# Altium schematic sheet Single_channel_Mobo.SchDoc
size A3
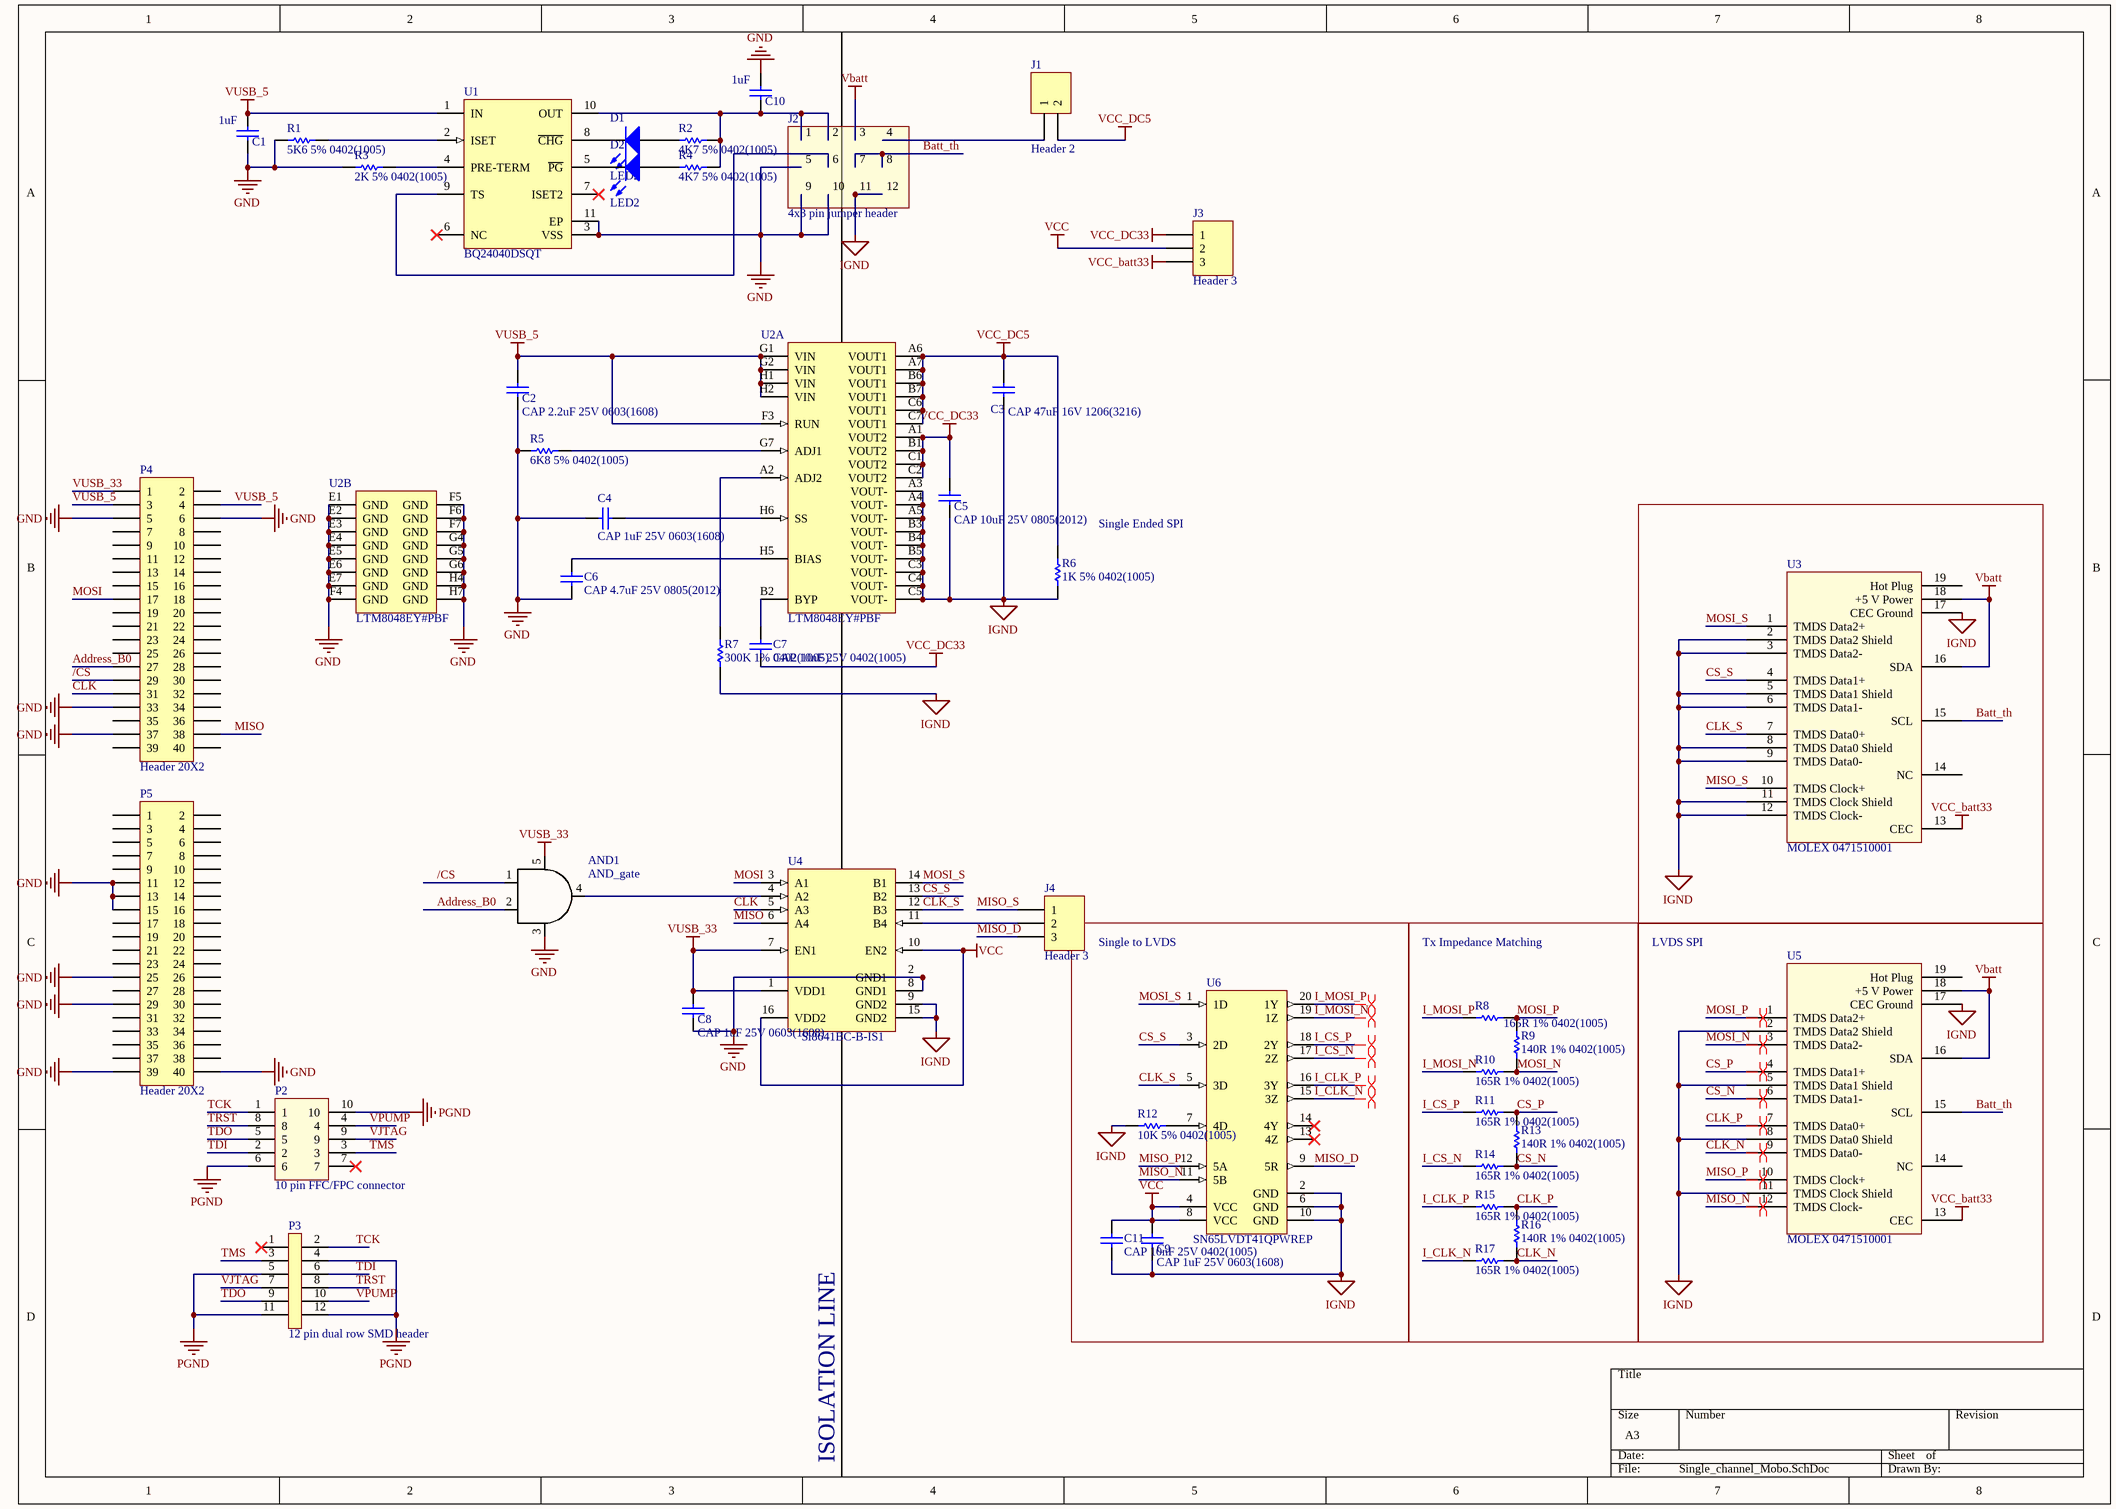
[diagram p0: Single_channel_Mobo.SchDoc]

## Parts
AND1  AND_gate  [TSOP5]
C1  value 1uF  [CAPC0603(1608)100_L]  (hidden comment: CAP 1uF 25V 0603(1608))
C2  CAP 2.2uF 25V 0603(1608)  [CAPC0603(1608)100_M]
C3  CAP 47uF 16V 1206(3216)  [CAPC1206(3216)190_M]
C4  CAP 1uF 25V 0603(1608)  [CAPC0603(1608)100_L]
C5  CAP 10uF 25V 0805(2012)  [CAPC0805(2012)145_N]
C6  CAP 4.7uF 25V 0805(2012)  [CAPC0805(2012)145_L]
C7  CAP 10nF 25V 0402(1005)  [CAPC0402(1005)60_L]
C8  CAP 1uF 25V 0603(1608)  [CAPC0603(1608)100_L]
C9  CAP 1uF 25V 0603(1608)  [CAPC0603(1608)100_L]
C10  value 1uF  [CAPC0603(1608)100_L]  (hidden comment: CAP 1uF 25V 0603(1608))
C11  CAP 10nF 25V 0402(1005)  [CAPC0402(1005)60_L]
D1  LED2  [LED 0610]
D2  LED2  [LED 0610]
J1  Header 2  [HDR1X2]
J2  4x3 pin jumper header  [4x3 pin jumper header]
J3  Header 3  [HDR1X3]
J4  Header 3  [HDR1X3]
P2  10 pin FFC/FPC connector  [10 FFC/FPC connector 0.5mm pitch]
P3  12 pin dual row SMD header  [TSM-106-01-S-DH]
P4  Header 20X2
P5  Header 20X2
R1  5K6 5% 0402(1005)  [RESC0402(1005)_L]
R2  4K7 5% 0402(1005)  [RESC0402(1005)_L]
R3  2K 5% 0402(1005)  [RESC0402(1005)_N]
R4  4K7 5% 0402(1005)  [RESC0402(1005)_L]
R5  6K8 5% 0402(1005)  [RESC0402(1005)_M]
R6  1K 5% 0402(1005)  [RESC0402(1005)_L]
R7  300K 1% 0402(1005)  [RESC0402(1005)_L]
R8  165R 1% 0402(1005)  [RESC0402(1005)_M]
R9  140R 1% 0402(1005)  [RESC0402(1005)_M]
R10  165R 1% 0402(1005)  [RESC0402(1005)_M]
R11  165R 1% 0402(1005)  [RESC0402(1005)_M]
R12  10K 5% 0402(1005)  [RESC0402(1005)_N]
R13  140R 1% 0402(1005)  [RESC0402(1005)_M]
R14  165R 1% 0402(1005)  [RESC0402(1005)_M]
R15  165R 1% 0402(1005)  [RESC0402(1005)_M]
R16  140R 1% 0402(1005)  [RESC0402(1005)_M]
R17  165R 1% 0402(1005)  [RESC0402(1005)_M]
U1  BQ24040DSQT  [DSQ10-1500X900TP]
U2  LTM8048EY#PBF  [LT-BGA-45-11250X9000X4920]  (parts A,B of 2)
U3  MOLEX 0471510001  [MOLEX 0471510001]
U4  Si8641BC-B-IS1  [SLAB-SOIC-16-NB_M]
U5  MOLEX 0471510001  [MOLEX 0471510001]
U6  SN65LVDT41QPWREP  [PW20_L]

## Blocks framed on the sheet
Single to LVDS: C9 C11 R12 U6
Tx Impedance Matching: R8-R11 R13-R17
LVDS SPI: U5

## Nets
GND: AND1.3(GND) C1.1 C2.1 C4.2 C6.2 C8.1 C10.2 J2.5 J2.9 J2.10 P4.5 P4.6 P4.33 P4.37 P5.11 P5.13 P5.15 P5.25 P5.29 P5.39 P5.40 R1.2 R3.2 R5.2 U1.3(VSS) U1.11(EP) U2.E1(GND) U2.E2(GND) U2.E3(GND) U2.E4(GND) U2.E5(GND) U2.E6(GND) U2.E7(GND) U2.F4(GND) U2.F5(GND) U2.F6(GND) U2.F7(GND) U2.G4(GND) U2.G5(GND) U2.G6(GND) U2.H4(GND) U2.H7(GND) U4.2(GND1) U4.8(GND1)
IGND: C3.1 C5.1 C9.1 C11.1 J2.11 J2.12 R6.1 R7.2 R12.1 U2.A3(VOUT-) U2.A4(VOUT-) U2.A5(VOUT-) U2.B3(VOUT-) U2.B4(VOUT-) U2.B5(VOUT-) U2.C3(VOUT-) U2.C4(VOUT-) U2.C5(VOUT-) U3.2(TMDS_Data2_Shield) U3.3(TMDS_Data2-) U3.5(TMDS_Data1_Shield) U3.6(TMDS_Data1-) U3.8(TMDS_Data0_Shield) U3.9(TMDS_Data0-) U3.11(TMDS_Clock_Shield) U3.12(TMDS_Clock-) U3.17(CEC_Ground) U4.9(GND2) U4.15(GND2) U5.2(TMDS_Data2_Shield) U5.5(TMDS_Data1_Shield) U5.8(TMDS_Data0_Shield) U5.11(TMDS_Clock_Shield) U5.17(CEC_Ground) U6.2(GND) U6.6(GND) U6.10(GND)
PGND: P2.6 P2.10 P3.4 P3.5 P3.11 P3.12
Vbatt: J2.3 U3.16(SDA) U3.18(+5_V_Power) U5.16(SDA) U5.18(+5_V_Power)
VCC: C9.2 C11.2 J3.2 U4.10(EN2) U4.16(VDD2) U6.4(VCC) U6.8(VCC)
VCC_batt33: J3.3 U3.13(CEC) U5.13(CEC)
VCC_DC5: C3.2 J1.2 R6.2 U2.A6(VOUT1) U2.A7(VOUT1) U2.B6(VOUT1) U2.B7(VOUT1) U2.C6(VOUT1) U2.C7(VOUT1)
VCC_DC33: C5.2 C7.1 J3.1 U2.A1(VOUT2) U2.B1(VOUT2) U2.C1(VOUT2) U2.C2(VOUT2)
VUSB_5: C1.2 C2.2 P4.3 P4.4 U1.1(IN) U2.F3(RUN) U2.G1(VIN) U2.G2(VIN) U2.H1(VIN) U2.H2(VIN)
VUSB_33: AND1.5(VCC) C8.2 P4.1 U4.1(VDD1) U4.7(EN1)
/CS: AND1.1(B) P4.29
Address_B0: AND1.2(A) P4.27
Batt_th: J2.7 J2.8 U3.15(SCL) U5.15(SCL)
CLK: P4.31 U4.5(A3)
CLK_N: R16.1 R17.1 U5.9(TMDS_Data0-)
CLK_P: R15.1 R16.2 U5.7(TMDS_Data0+)
CLK_S: U3.7(TMDS_Data0+) U4.12(B3) U6.5(3D)
CS_N: R13.1 R14.1 U5.6(TMDS_Data1-)
CS_P: R11.1 R13.2 U5.4(TMDS_Data1+)
CS_S: U3.4(TMDS_Data1+) U4.13(B2) U6.3(2D)
I_CLK_N: R17.2 U6.15(3Z)
I_CLK_P: R15.2 U6.16(3Y)
I_CS_N: R14.2 U6.17(2Z)
I_CS_P: R11.2 U6.18(2Y)
I_MOSI_N: R10.2 U6.19(1Z)
I_MOSI_P: R8.2 U6.20(1Y)
MISO: P4.38 U4.6(A4)
MISO_D: J4.3 U6.9(5R)
MISO_N: U5.12(TMDS_Clock-) U6.11(5B)
MISO_P: U5.10(TMDS_Clock+) U6.12(5A)
MISO_S: J4.1 U3.10(TMDS_Clock+)
MOSI: P4.17 U4.3(A1)
MOSI_N: R9.1 R10.1 U5.3(TMDS_Data2-)
MOSI_P: R8.1 R9.2 U5.1(TMDS_Data2+)
MOSI_S: U3.1(TMDS_Data2+) U4.14(B1) U6.1(1D)
TCK: P2.1 P3.2
TDI: P2.2 P3.6
TDO: P2.5 P3.9
TMS: P2.3 P3.3
TRST: P2.8 P3.8
VJTAG: P2.9 P3.7
VPUMP: P2.4 P3.10
NetAND1_4: AND1.4(Y) U4.4(A2)
NetC4_1: C4.1 U2.H6(SS)
NetC6_1: C6.1 U2.H5(BIAS)
NetC7_2: C7.2 U2.B2(BYP)
NetC10_1: C10.1 J2.1 J2.2 R2.2 R4.1 U1.10(OUT)
NetD1_1: D1.1(A) R2.1
NetD1_2: D1.2(K) U1.8(~{CHG})
NetD2_1: D2.1(A) R4.2
NetD2_2: D2.2(K) U1.5(~{PG})
NetJ1_1: J1.1 J2.4
NetJ2_6: J2.6 U1.9(TS)
NetJ4_2: J4.2 U4.11(B4)
NetR1_1: R1.1 U1.2(ISET)
NetR3_1: R3.1 U1.4(PRE-TERM)
NetR5_1: R5.1 U2.G7(ADJ1)
NetR7_1: R7.1 U2.A2(ADJ2)
NetR12_2: R12.2 U6.7(4D)

Not connected (* = marked no-connect by the designer): P2 7*; P3 1*; P4 2 7 8 9 10 11 12 13 14 15 16 18 19 20 21 22 23 24 25 26 28 30 32 34 35 36 39 40; P5 1 2 3 4 5 6 7 8 9 10 12 14 16 17 18 19 20 21 22 23 24 26 27 28 30 31 32 33 34 35 36 37 38; U1 6(NC)* 7(ISET2)*; U3 14(NC) 19(Hot_Plug); U5 14(NC) 19(Hot_Plug); U6 13(4Z)* 14(4Y)*

## Layout directives
differential pair: CLK_N, CLK_P, CS_N, CS_P, I_CLK_N, I_CLK_P, I_CS_N, I_CS_P, I_MOSI_N, I_MOSI_P, MISO_N, MISO_P, MOSI_N, MOSI_P

## Notes on the sheet
- (near R6) Single Ended SPI
- ISOLATION LINE

## Library data of the parts
C1 C4 C8-C10 = CMP-1035-02740-1: CAP 1uF 25V ±10% 0603 (1608 Metric) Thickness 1mm SMD; Case-Metric: 1608; Case-EIA: 0603; Technology: SMT; Tolerance: ±10%; Max Thickness: 1 mm; Rated Voltage: 25 V
  C4 C8 C9: Value: 1uF
C2 = CMP-1035-02767-1: CAP 2.2uF 25V ±10% 0603 (1608 Metric) Thickness 1mm SMD; Case-Metric: 1608; Case-EIA: 0603; Technology: SMT; Value: 2.2uF; Tolerance: ±10%; Max Thickness: 1 mm; Rated Voltage: 25 V
C3 = CMP-1037-05003-1: CAP 47uF 16V ±20% 1206 (3216 Metric) Thickness 1.9mm SMD; Case-Metric: 3216; Case-EIA: 1206; Tolerance: ±20%; Value: 47uF; Technology: SMT; Max Thickness: 1.9 mm; Rated Voltage: 16 V
C5 = CMP-1036-04932-1: CAP 10uF 25V ±10% 0805 (2012 Metric) Thickness 1.45mm SMD; Case-Metric: 2012; Case-EIA: 0805; Technology: SMT; Value: 10uF; Tolerance: ±10%; Max Thickness: 1.45 mm; Rated Voltage: 25 V
C6 = CMP-1036-04895-1: CAP 4.7uF 25V ±10% 0805 (2012 Metric) Thickness 1.45mm SMD; Case-Metric: 2012; Case-EIA: 0805; Value: 4.7uF; Technology: SMT; Tolerance: ±10%; Max Thickness: 1.45 mm; Rated Voltage: 25 V
C7 C11 = CMP-1034-01879-1: CAP 10nF 25V ±5% 0402 (1005 Metric) Thickness 0.6mm SMD; Case-Metric: 1005; Case-EIA: 0402; Value: 10nF; Tolerance: ±5%; Technology: SMT; Max Thickness: 0.6 mm; Rated Voltage: 25 V
D1 D2 = LED2: Typical RED, GREEN, YELLOW, AMBER GaAs LED; Published: 8-Jun-2000; LatestRevisionDate: 17-Jul-2002; LatestRevisionNote: Re-released for DXP Platform.; PackageVersion: Feb-2002; PackageReference: 3.2X1.6X1.1; Publisher: Altium Limited; PackageDescription: SM LED; 2 Flat Leads
J1 = Header 2: Header, 2-Pin; LatestRevisionDate: 17-Jul-2002; LatestRevisionNote: Re-released for DXP Platform.; Publisher: Altium Limited
J3 J4 = Header 3: Header, 3-Pin; LatestRevisionDate: 17-Jul-2002; LatestRevisionNote: Re-released for DXP Platform.; Publisher: Altium Limited
P3 = 12 pin dual row SMD header: header
P4 P5 = Header 20X2: Header, 20-Pin, Dual row; LatestRevisionDate: 17-Jul-2002; LatestRevisionNote: Re-released for DXP Platform.; Publisher: Altium Limited
R1 = CMP-1011-00092-1: 5K6 0.063W 5% 0402 (1005 Metric)  SMD; Case-Metric: 1005; Value: 5600.00 Ohm; Case-EIA: 0402; Technology: SMT; Tolerance: 5 %; Power: 0.063 W
R2 R4 = CMP-1011-00090-1: 4K7 0.063W 5% 0402 (1005 Metric)  SMD; Value: 4700.00 Ohm; Case-Metric: 1005; Case-EIA: 0402; Tolerance: 5 %; Power: 0.063 W; Technology: SMT
R3 = CMP-1011-00081-1: 2K 0.063W 5% 0402 (1005 Metric)  SMD; Case-Metric: 1005; Value: 2000.00 Ohm; Case-EIA: 0402; Power: 0.063 W; Technology: SMT; Tolerance: 5 %
R5 = CMP-1011-00094-1: 6K8 0.063W 5% 0402 (1005 Metric)  SMD; Value: 6800.00 Ohm; Case-Metric: 1005; Case-EIA: 0402; Power: 0.063 W; Tolerance: 5 %; Technology: SMT
R6 = CMP-1011-00074-1: 1K 0.063W 5% 0402 (1005 Metric)  SMD; Value: 1000.00 Ohm; Case-Metric: 1005; Case-EIA: 0402; Tolerance: 5 %; Power: 0.063 W; Technology: SMT
R7 = CMP-1011-00788-1: 300K 0.063W 1% 0402 (1005 Metric)  SMD; Case-Metric: 1005; Value: 300000.00 Ohm; Case-EIA: 0402; Technology: SMT; Tolerance: 1 %; Power: 0.063 W
R8 R10 R11 R14 R15 R17 = CMP-1011-00420-1: 165R 0.063W 1% 0402 (1005 Metric)  SMD; Case-Metric: 1005; Value: 165.00 Ohm; Case-EIA: 0402; Power: 0.063 W; Technology: SMT; Tolerance: 1 %
R9 R13 R16 = CMP-1011-00412-1: 140R 0.063W 1% 0402 (1005 Metric)  SMD; Case-Metric: 1005; Value: 140.00 Ohm; Case-EIA: 0402; Power: 0.063 W; Technology: SMT; Tolerance: 1 %
R12 = CMP-1011-00098-1: 10K 0.063W 5% 0402 (1005 Metric)  SMD; Case-Metric: 1005; Value: 10000.00 Ohm; Case-EIA: 0402; Technology: SMT; Tolerance: 5 %; Power: 0.063 W
U1 = CMP-0321-00457-1: 800 mA, Single-Input, Single Cell Li-Ion Battery Charger with Auto Start. Vovp=6.6 V, 3.5 V, -40 to 85 degC, 10-pin SON (DSQ), Green (RoHS & no Sb/Br); Manufacturer: Texas Instruments; SubFamily: Battery Charge Management; Li-Ion: N; Vin(Min)(V): 3.5; PartNumber: BQ24040DSQT; PackageVersion: revB, Apr-2010; Mounting Technology: Surface Mount; Eco-Plan: Green (RoHS & no Sb/Br); PackageReference: DSQ10-1500X900TP; ComponentLink1Description: Datasheet; DatasheetVersion: SLUS941A; Li-Polymer: N; PackageDescription: 10-Pin Plastic Small Outline No-Lead, 2 x 2 x 0.8 mm Body, 0.4 mm Pitch, Exposed Pad; NiMH: N; Over Voltage Protection: N; Lead Acid: N; ComponentLink1URL: http://www.ti.com/general/docs/lit/getliterature.tsp?genericPartNumber=BQ24040&fileType=pdf; NiCd: N
U2 = CMP-0483-00034-1: 3.1 VIN to 32 VIN Isolated uModule DC/DC Converter with LDO Post Regulator, 45-pin BGA, -40 to 125 degC, Pb-Free, Tray; Manufacturer: Linear Technology; Extended Temp: E, I, MP; Ishutdown(uA): 1; Isupply(mA): 0.85; Number of Outputs: 2; Output Current(A): 0.44; Synchronous: no; Topology: Buck, LDO; Vin Max(V): 32; Vin Min(V): 3.1; Vout Max(V): 13; Vout Min(V): 1.2; PackageReference: BGA-45; PackageDescription: 45-Ball BGA, Body 11.25 x 9 mm, Pitch 1.27 mm; PackageVersion: Rev. A, 01/2013; Code_JEDEC: MS-028; ComponentLink1Description: Manufacturer URL; ComponentLink1URL: http://www.linear.com/; ComponentLink2Description: Datasheet; ComponentLink2URL: http://cds.linear.com/docs/en/datasheet/8048fd.pdf; ComponentLink3Description: Package Specification; ComponentLink3URL: http://cds.linear.com/docs/en/packaging/05081869_A_bga45.pdf; DatasheetVersion: Rev. D; Mounting Technology: Surface Mount; Packing: Tray; PartNumber: LTM8048EY#PBF; RoHS: TRUE; Tracking: no
U3 U5 = MOLEX 0471510001: MOLEX 0471510001 hdmi connector
U4 = CMP-0512-00190-1: Low-Power Quad-Channel Digital Isolator, 150 Mbps, 3.75 kVRMS Isolation Rating, -40 to 125 degC, 16-pin SOIC; Manufacturer: Silicon Labs; Maximum Data Rate (Mbps): 150; Maximum Propagation Delay (ns): 13; Sub-Family: Isolators; Enable Control: TRUE; Isolation Rating (kV): 3.75; Channel Type: Unidirectional; 10kV surge: FALSE; PackageDescription: 16-Pin Small-Outline Integrated Circuit, Body 9.9 x 3.9 mm, Pitch 1.27 mm; PackageReference: SOIC-16-NB; Code_IPC: J-STD-020; ComponentLink1URL: http://www.silabs.com/; ComponentLink1Description: Manufacturer URL; DatasheetVersion: Rev. 1.5; Code_JEDEC: MS-012; ComponentLink2Description: Datasheet; ComponentLink3URL: http://www.silabs.com/Support%20Documents/TechnicalDocs/si2401.pdf; ComponentLink2URL: http://www.silabs.com/Support%20Documents/TechnicalDocs/Si864x.pdf; PartNumber: Si8641BC-B-IS1; ComponentLink3Description: Package Specification; Mounting Technology: Surface Mount; AEC-Q100: FALSE
U6 = CMP-0327-00207-1: Enhanced Product Memorystick™ Interconnect Extender Chipset, -40 to +125 degC, 20-Pin TSSOP (PW), Green (RoHS & no Sb/Br); Manufacturer: Texas Instruments; SubFamily: LVDS PHY (<800Mbps); PackageDescription: 20-Pin Plastic Thin Small Outline Package 6.5 x 4.4 mm Body ,0.65 mm Pitch; PackageVersion: revG, Feb-2011; PackageReference: PW20; ComponentLink2Description: URL Link1; Code_JEDEC: MO-153; Mounting Technology: Surface Mount; ComponentLink2URL: SamplesURL:http://www.ti.com/product/sn65lvdt41-ep#samples; PartNumber: SN65LVDT41QPWREP; DatasheetVersion: SCES633; ComponentLink1Description: Datasheet; Eco-Plan: Green (RoHS & no Sb/Br); ComponentLink1URL: http://www.ti.com/general/docs/lit/getliterature.tsp?genericPartNumber=SN65LVDT41-EP&fileType=pdf